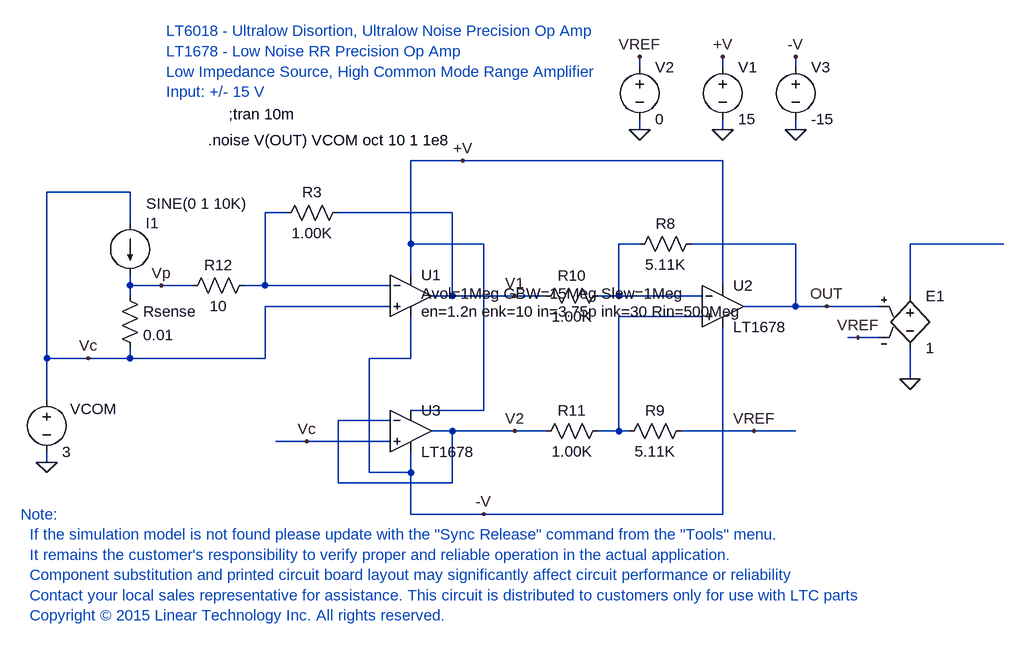
[diagram p0: schematic LT6018_INA2_sim_noise.asc]
LT6018_INA2_sim_noise.asc, the LTspice schematic file:
Version 4
SHEET 1 2004 700
WIRE 848 -144 848 -160
WIRE 976 -144 976 -160
WIRE 1088 -144 1088 -160
WIRE 848 -48 848 -64
WIRE 976 -48 976 -64
WIRE 1088 -48 1088 -64
WIRE 576 0 496 0
WIRE 976 0 576 0
WIRE 64 48 -64 48
WIRE 304 80 272 80
WIRE 560 80 384 80
WIRE 64 96 64 48
WIRE 496 128 496 0
WIRE 608 128 496 128
WIRE 848 128 816 128
WIRE 1088 128 928 128
WIRE 1408 128 1264 128
WIRE 496 176 496 128
WIRE 64 192 64 176
WIRE 112 192 64 192
WIRE 160 192 112 192
WIRE 272 192 272 80
WIRE 272 192 240 192
WIRE 464 192 272 192
WIRE 976 192 976 0
WIRE 64 208 64 192
WIRE 560 208 560 80
WIRE 560 208 528 208
WIRE 656 208 560 208
WIRE 704 208 656 208
WIRE 816 208 816 128
WIRE 816 208 784 208
WIRE 944 208 816 208
WIRE 1264 208 1264 128
WIRE 464 224 272 224
WIRE 1088 224 1088 128
WIRE 1088 224 1008 224
WIRE 1136 224 1088 224
WIRE 1216 224 1136 224
WIRE 944 240 816 240
WIRE 1184 272 1168 272
WIRE 1216 272 1184 272
WIRE -64 304 -64 48
WIRE 0 304 -64 304
WIRE 64 304 64 288
WIRE 64 304 0 304
WIRE 272 304 272 224
WIRE 272 304 64 304
WIRE 496 304 496 240
WIRE 496 304 432 304
WIRE 1264 336 1264 288
WIRE -64 368 -64 304
WIRE 608 384 608 128
WIRE 608 384 496 384
WIRE 464 400 384 400
WIRE 560 416 528 416
WIRE 656 416 560 416
WIRE 704 416 656 416
WIRE 816 416 816 240
WIRE 816 416 784 416
WIRE 832 416 816 416
WIRE 1024 416 912 416
WIRE 1088 416 1024 416
WIRE 336 432 288 432
WIRE 464 432 336 432
WIRE -64 464 -64 448
WIRE 432 480 432 304
WIRE 496 480 496 448
WIRE 496 480 432 480
WIRE 384 496 384 400
WIRE 560 496 560 416
WIRE 560 496 384 496
WIRE 496 544 496 480
WIRE 608 544 496 544
WIRE 976 544 976 256
WIRE 976 544 608 544
FLAG 976 -48 0
FLAG 1088 -48 0
FLAG 976 -160 +V
FLAG 1088 -160 -V
FLAG 576 0 +V
FLAG 848 -48 0
FLAG -64 464 0
FLAG 608 544 -V
FLAG 1024 416 VREF
FLAG 848 -160 VREF
FLAG 656 208 V1
FLAG 656 416 V2
FLAG 336 432 Vc
FLAG 112 192 Vp
FLAG 0 304 Vc
FLAG 1184 272 VREF
FLAG 1264 336 0
FLAG 1136 224 OUT
SYMBOL Opamps\\LT1678 976 224 R0
SYMATTR InstName U2
SYMBOL voltage 976 -160 R0
WINDOW 123 0 0 Left 2
WINDOW 39 0 0 Left 2
SYMATTR InstName V1
SYMATTR Value 15
SYMBOL voltage 1088 -160 R0
WINDOW 123 0 0 Left 2
WINDOW 39 0 0 Left 2
SYMATTR InstName V3
SYMATTR Value -15
SYMBOL res 944 112 R90
WINDOW 0 0 56 VBottom 2
WINDOW 3 32 56 VTop 2
SYMATTR InstName R8
SYMATTR Value 5.11K
SYMATTR SpiceLine tol=1 pwr=0.1
SYMBOL res 928 400 R90
WINDOW 0 0 56 VBottom 2
WINDOW 3 32 56 VTop 2
SYMATTR InstName R9
SYMATTR Value 5.11K
SYMATTR SpiceLine tol=1 pwr=0.1
SYMBOL res 800 192 R90
WINDOW 0 0 56 VBottom 2
WINDOW 3 32 56 VTop 2
SYMATTR InstName R10
SYMATTR Value 1.00K
SYMATTR SpiceLine tol=1 pwr=0.1
SYMBOL res 800 400 R90
WINDOW 0 0 56 VBottom 2
WINDOW 3 32 56 VTop 2
SYMATTR InstName R11
SYMATTR Value 1.00K
SYMATTR SpiceLine tol=1 pwr=0.1
SYMBOL res 256 176 R90
WINDOW 0 0 56 VBottom 2
WINDOW 3 32 56 VTop 2
SYMATTR InstName R12
SYMATTR Value 10
SYMATTR SpiceLine tol=1 pwr=0.1
SYMBOL res 400 64 R90
WINDOW 0 0 56 VBottom 2
WINDOW 3 32 56 VTop 2
SYMATTR InstName R3
SYMATTR Value 1.00K
SYMATTR SpiceLine tol=1 pwr=0.1
SYMBOL voltage 848 -160 R0
WINDOW 123 0 0 Left 2
WINDOW 39 0 0 Left 2
SYMATTR InstName V2
SYMATTR Value 0
SYMBOL current 64 96 R0
WINDOW 3 25 -30 Left 2
WINDOW 123 0 0 Left 2
WINDOW 39 0 0 Left 2
SYMATTR Value SINE(0 1 10K)
SYMATTR InstName I1
SYMBOL voltage -64 352 R0
WINDOW 123 0 0 Left 2
WINDOW 39 0 0 Left 2
WINDOW 0 36 30 Left 2
SYMATTR InstName VCOM
SYMATTR Value 3
SYMBOL res 48 192 R0
SYMATTR InstName Rsense
SYMATTR Value 0.01
SYMATTR SpiceLine tol=1 pwr=0.1
SYMBOL Opamps\\UniversalOpamp2 496 208 R0
WINDOW 123 16 -4 Left 2
WINDOW 40 16 24 Left 2
SYMATTR Value2 Avol=1Meg GBW=15Meg Slew=1Meg
SYMATTR SpiceLine2 en=1.2n enk=10 in=3.75p ink=30 Rin=500Meg
SYMATTR InstName U1
SYMBOL e 1264 192 R0
SYMATTR InstName E1
SYMATTR Value 1
SYMBOL Opamps\\LT1678 496 416 R0
SYMATTR InstName U3
TEXT -104 544 Left 2 ;Note:\n  If the simulation model is not found please update with the "Sync Release" command from the "Tools" menu.\n  It remains the customer's responsibility to verify proper and reliable operation in the actual application.\n  Component substitution and printed circuit board layout may significantly affect circuit performance or reliability\n  Contact your local sales representative for assistance. This circuit is distributed to customers only for use with LTC parts\n  Copyright © 2015 Linear Technology Inc. All rights reserved.
TEXT 120 -200 Left 2 ;LT6018 - Ultralow Disortion, Ultralow Noise Precision Op Amp\nLT1678 - Low Noise RR Precision Op Amp\nLow Impedance Source, High Common Mode Range Amplifier\nInput: +/- 15 V
TEXT 216 -72 Left 2 !;tran 10m
TEXT 184 -32 Left 2 !.noise V(OUT) VCOM oct 10 1 1e8

The netlist it stands for:
* LT6018_INA2_sim_noise.asc
XU2 N004 N002 OUT +V -V LT1678  ; pins In+ In- OUT V+ V-
V1 +V 0 15
V3 -V 0 -15
R8 OUT N002 5.11K tol=1 pwr=0.1
R9 VREF N004 5.11K tol=1 pwr=0.1
R10 N002 V1 1.00K tol=1 pwr=0.1
R11 N004 V2 1.00K tol=1 pwr=0.1
R12 N001 Vp 10 tol=1 pwr=0.1
R3 V1 N001 1.00K tol=1 pwr=0.1
V2 VREF 0 0
I1 Vc Vp SINE(0 1 10K)
VCOM Vc 0 3
Rsense Vp Vc 0.01 tol=1 pwr=0.1
XU1 Vc N001 +V -V V1 level.2 Avol=1Meg GBW=15Meg Slew=1Meg ilimit=25m rail=0 Vos=0 phimargin=45 en=1.2n enk=10 in=3.75p ink=30 Rin=500Meg  ; pins IN+ IN- V+ V- OUT
E1 N003 0 OUT VREF 1
XU3 Vc V2 V2 +V -V LT1678  ; pins In+ In- OUT V+ V-
* Note:
*   If the simulation model is not found please update with the "Sync Release" command from the "Tools" menu.
*   It remains the customer's responsibility to verify proper and reliable operation in the actual application.
*   Component substitution and printed circuit board layout may significantly affect circuit performance or reliability
*   Contact your local sales representative for assistance. This circuit is distributed to customers only for use with LTC parts
*   Copyright © 2015 Linear Technology Inc. All rights reserved.
* LT6018 - Ultralow Disortion, Ultralow Noise Precision Op Amp
* LT1678 - Low Noise RR Precision Op Amp
* Low Impedance Source, High Common Mode Range Amplifier
* Input: +/- 15 V
;tran 10m
.noise V(OUT) VCOM oct 10 1 1e8
.lib UniversalOpamps2.sub
.backanno
.end